# Altium schematic sheet 2_IsoCAN.SchDoc: Isolation, CAN driver, connectors
size 292 x 206 mm; DrawnBy: Martin Cejp; SheetNumber: 2; SheetTotal: 2; TemplateRevision: v2.0
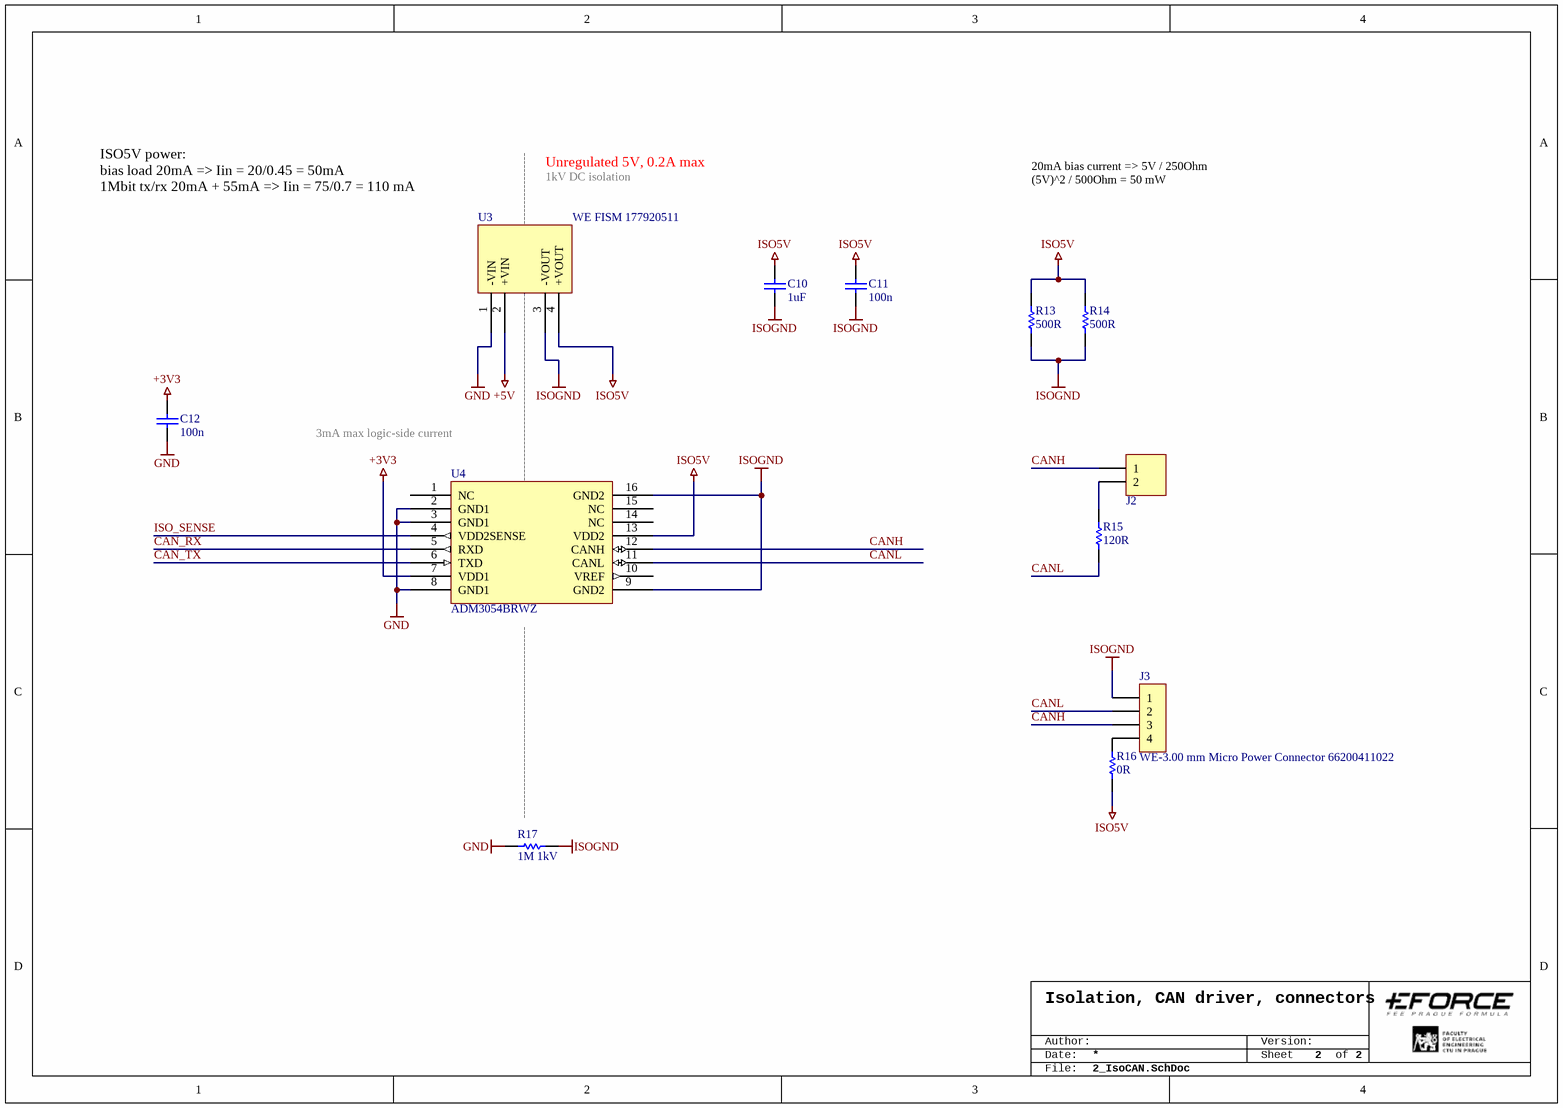
[diagram p0: 2_IsoCAN.SchDoc]

## Parts
C10  1uF  [CAPC0805(2012)145_M]
C11  100n  [CAPC0603(1608)100_M]
C12  100n  [CAPC0603(1608)100_M]
J2  02p  [61300211121]  (value not drawn)
J3  WE-3.00 mm Micro Power Connector 66200411022  [66200411022]
R13  500R  [RESC0603(1608)_L]
R14  500R  [RESC0603(1608)_L]
R15  120R  [RESC0603(1608)_L]
R16  0R  [RESC0603(1608)_L]
R17  1M 1kV  [RESC1206(3216)_L]
U3  WE FISM 177920511  [FISM_17792XXX1]
U4  ADM3054BRWZ  [SOIC127P1030X265-16N]

## Nets
+3V3: C12.2 U4.7(VDD1)
+5V: U3.2(+VIN)
GND: C12.1 R17.1 U3.1(-VIN) U4.2(GND1) U4.3(GND1) U4.8(GND1)
ISO5V: C10.2 C11.2 R13.2 R14.2 R16.1 U3.4(+VOUT) U4.13(VDD2)
ISOGND: C10.1 C11.1 J3.1 R13.1 R14.1 R17.2 U3.3(-VOUT) U4.9(GND2) U4.16(GND2)
CAN_RX: U4.5(RXD)
CAN_TX: U4.6(TXD)
CANH: J2.1 J3.3 U4.12(CANH)
CANL: J3.2 R15.1 U4.11(CANL)
ISO_SENSE: U4.4(VDD2SENSE)
NetJ2_2: J2.2 R15.2
NetJ3_4: J3.4 R16.2

Not connected (* = marked no-connect by the designer): U4 1(NC) 10(VREF) 14(NC) 15(NC)

## Notes on the sheet
- Unregulated 5V, 0.2A max
- 1kV DC isolation
- ISO5V power:
  bias load 20mA => Iin = 20/0.45 = 50mA
  1Mbit tx/rx 20mA + 55mA => Iin = 75/0.7 = 110 mA
- ------------------
- 20mA bias current => 5V / 250Ohm
  (5V)^2 / 500Ohm = 50 mW
- 3mA max logic-side current
- (near U3) ------------------------------------------------
- (near U4) ------------------------------------------------
- Date:
- Author:
- Sheet
- Version:
- of
- File:

## Library data of the parts
C10 = CMP-1036-04748-1: CAP 1uF 16V ±20% 0805 (2012 Metric) Thickness 1.45mm SMD; Tolerance: Â±20%; Case-Metric: 2012; Case-EIA: 0805; Technology: SMT; Value: 1uF; Rated Voltage: 16 V; Max Thickness: 1.45 mm
C11 C12 = CMP-1035-02576-1: CAP 100nF 6.3V ±10% 0603 (1608 Metric) Thickness 1mm SMD; Tolerance: Â±10%; Case-Metric: 1608; Case-EIA: 0603; Max Thickness: 1 mm; Value: 100nF; Rated Voltage: 6.3 V; Technology: SMT
J2 = 61300211121: WR-PHD 2.54 mm THT Pin Header, 02p; PublishedDate: July 2016; Publisher: Wurth Elektronik; ComponentLink1Description: Manufacturer; ComponentLink1URL: http://www.we-online.de; ComponentLink2Description: Datasheet; ComponentLink2URL: http://katalog.we-online.de/em/datasheet/6130xx11121.pdf; PartNumber: 61300211121; PinNumber: 02p
J3 = WE-3.00 mm Micro Power Connector 66200411022: WR-MPC3 3.00 mm Male Single Row Angled Header; Manufacturer: W¨ąrth Elektronik eiSos GmbH; ComponentLink1 Description: Manufacturer; ComponentLink2 Description: Datasheet; NoPins: 04; Created Date: 28 August 2013; partNo: 66200411022; ComponentLink1URL: http://www.we-online.com; ComponentLink2URL: http://katalog.we-online.de/em/datasheet/6620xx11022.pdf; Created by: Karrer Zheng
R13-R15 = CMP-1012-00052-1: 120R 0.1W 5% 0603 (1608 Metric)  SMD; Case-EIA: 0603; Value: 120.00 Ohm; Case-Metric: 1608; Technology: SMT; Power: 0.1 W; Tolerance: 5 %
R16 = CMP-1012-00052-1: 0R 0.1W 5% 0603 (1608 Metric)  SMD; Case-EIA: 0603; Value: 0.00 Ohm; Case-Metric: 1608; Technology: SMT; Power: 0.1 W; Tolerance: 5 %
R17 = CMP-1014-00146-1: 1M 0.25W 5% 1206 (3216 Metric)  SMD; Value: 1000000.00 Ohm; Case-EIA: 1206; Case-Metric: 3216; Power: 0.25 W; Technology: SMT; Tolerance: 5 %
U3 = 177920511